# Altium schematic sheet Sheet1.SchDoc
size A4
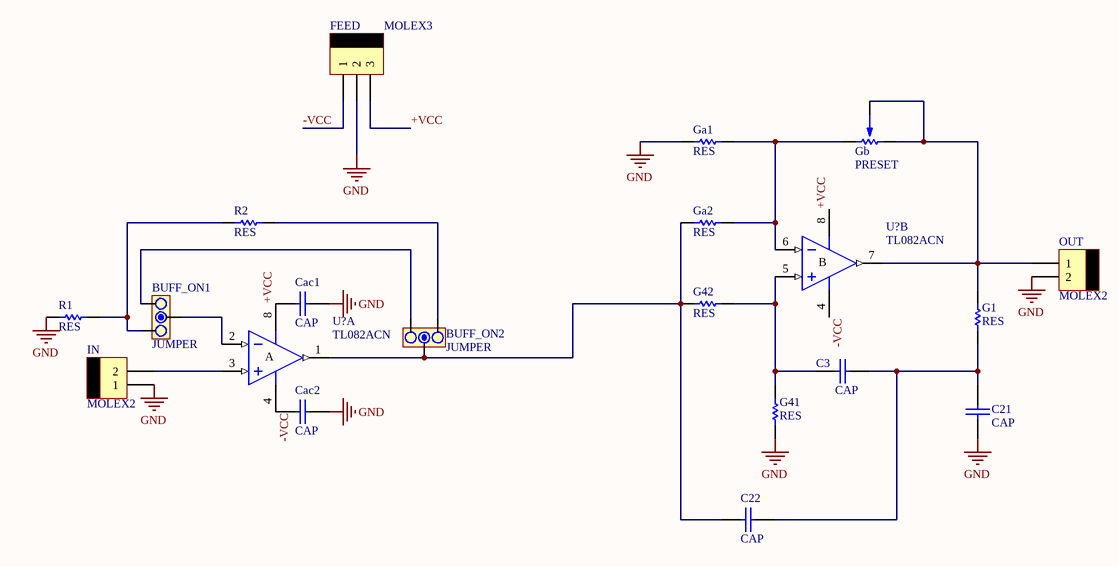
[diagram p0: Sheet1.SchDoc]

## Parts
(Parts that share a designator on the sheet are numbered #1, #2 ... from top to bottom, then left to right.)
BUFF_ON1  JUMPER  [JUMPER3]
BUFF_ON2  JUMPER  [JUMPER3]
C3  CAP  [CAP200]
C21  CAP  [CAP200]
C22  CAP  [CAP200]
Cac1  CAP  [CAP200]
Cac2  CAP  [CAP200]
FEED  MOLEX3  [MOLEX3]
G1  RES  [RES400]
G41  RES  [RES400]
G42  RES  [RES400]
Ga1  RES  [RES400]
Ga2  RES  [RES400]
Gb  PRESET  [PRESET H]
IN  MOLEX2  [MOLEX2]
OUT  MOLEX2  [MOLEX2]
R1  RES  [RES400]
R2  RES  [RES400]
U?#1  TL082ACN  [DIP8]  (part B of 2)
U?#2  TL082ACN  [DIP8]  (part A of 2)

## Nets
GND: C21.2 Cac1.2 Cac2.2 FEED.2 G41.1 Ga1.1 IN.1 OUT.2 R1.1
+VCC: Cac1.1 FEED.3 U?#1.8(V+) U?#2.8(V+)
-VCC: Cac2.1 FEED.1 U?#1.4(V-) U?#2.4(V-)
NetBUFF_ON1_1: BUFF_ON1.1 R1.2 R2.1
NetBUFF_ON1_2: BUFF_ON1.2 U?#2.2(IN-)
NetBUFF_ON1_3: BUFF_ON1.3 BUFF_ON2.1
NetBUFF_ON2_2: BUFF_ON2.2 C22.1 G42.1 Ga2.1 U?#2.1(OUT)
NetBUFF_ON2_3: BUFF_ON2.3 R2.2
NetC3_1: C3.1 G41.2 G42.2 U?#1.5(IN+)
NetC3_2: C3.2 C21.1 C22.2 G1.1
NetG1_2: G1.2 Gb.2 Gb.3 OUT.1 U?#1.7(OUT)
NetGa1_2: Ga1.2 Ga2.2 Gb.1 U?#1.6(IN-)
NetIN_2: IN.2 U?#2.3(IN+)

## Notes on the sheet
- (in symbol TL082ACN, part A) A
- (in symbol TL082ACN, part B) B

## Library data of the parts
BUFF_ON1 BUFF_ON2 = JUMPER3
U?#1 U?#2 = TL082ACN: General-Purpose J-FET Dual Operational Amplifier; Published: 24-Aug-2001; LatestRevisionDate: 06-Jun-2005; LatestRevisionNote: Stylized 3D Model Added.; DatasheetVersion: Jan-1999; PackageReference: DIP8; Publisher: Altium Limited; PackageDescription: DIP; 8 Leads; Row Spacing 7.62 mm; Pitch 2.54 mm; Code_JEDEC: MO-001-AN; ComponentLink1Description: Manufacturer Link; ComponentLink1URL: http://www.st.com/; ComponentLink2Description: Datasheet; ComponentLink2URL: http://www.st.com/stonline/products/literature/ds/2300/tl082.pdf